# Altium schematic sheet 17-AM64x-06.SchDoc
size B; SheetNumber: 17; SheetTotal: 25
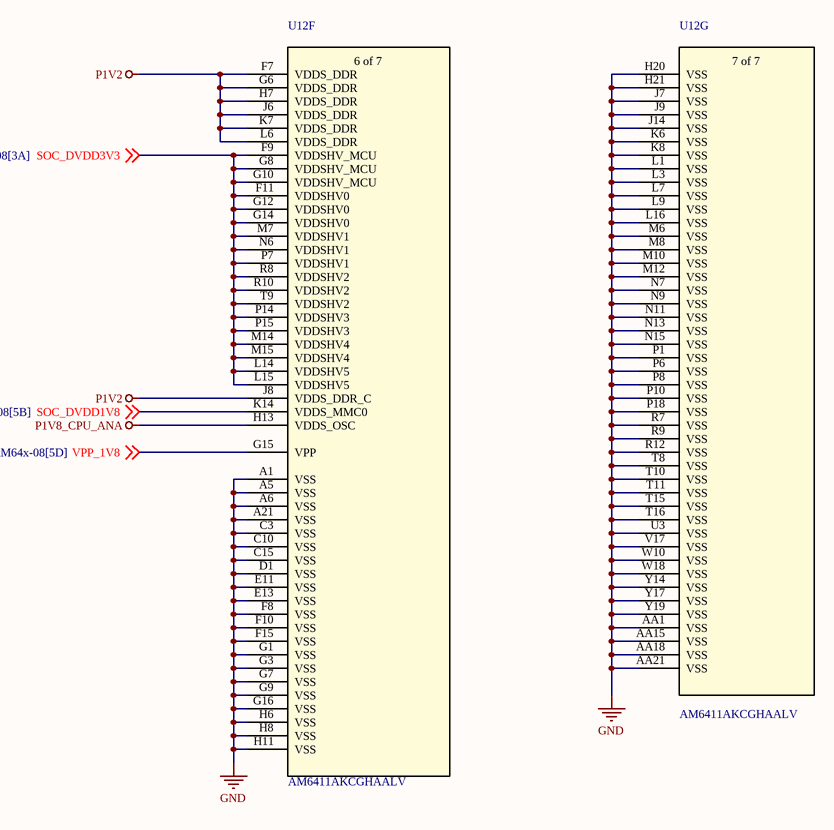
[diagram p0: 17-AM64x-06.SchDoc]

## Parts
U12  AM6411AKCGHAALV  [FCBGA441_ALV_TEX]  (parts F,G of 7)

## Nets
GND: U12.A1(VSS) U12.A5(VSS) U12.A6(VSS) U12.A21(VSS) U12.AA1(VSS) U12.AA15(VSS) U12.AA18(VSS) U12.AA21(VSS) U12.C3(VSS) U12.C10(VSS) U12.C15(VSS) U12.D1(VSS) U12.E11(VSS) U12.E13(VSS) U12.F8(VSS) U12.F10(VSS) U12.F15(VSS) U12.G1(VSS) U12.G3(VSS) U12.G7(VSS) U12.G9(VSS) U12.G16(VSS) U12.H6(VSS) U12.H8(VSS) U12.H11(VSS) U12.H20(VSS) U12.H21(VSS) U12.J7(VSS) U12.J9(VSS) U12.J14(VSS) U12.K6(VSS) U12.K8(VSS) U12.L1(VSS) U12.L3(VSS) U12.L7(VSS) U12.L9(VSS) U12.L16(VSS) U12.M6(VSS) U12.M8(VSS) U12.M10(VSS) U12.M12(VSS) U12.N7(VSS) U12.N9(VSS) U12.N11(VSS) U12.N13(VSS) U12.N15(VSS) U12.P1(VSS) U12.P6(VSS) U12.P8(VSS) U12.P10(VSS) U12.P18(VSS) U12.R7(VSS) U12.R9(VSS) U12.R12(VSS) U12.T8(VSS) U12.T10(VSS) U12.T11(VSS) U12.T15(VSS) U12.T16(VSS) U12.U3(VSS) U12.V17(VSS) U12.W10(VSS) U12.W18(VSS) U12.Y14(VSS) U12.Y17(VSS) U12.Y19(VSS)
P1V2: U12.F7(VDDS_DDR) U12.G6(VDDS_DDR) U12.H7(VDDS_DDR) U12.J6(VDDS_DDR) U12.J8(VDDS_DDR_C) U12.K7(VDDS_DDR) U12.L6(VDDS_DDR)
P1V8_CPU_ANA: U12.H13(VDDS_OSC)
SOC_DVDD1V8: U12.K14(VDDS_MMC0) ; off-sheet SOC_DVDD1V8
SOC_DVDD3V3: U12.F9(VDDSHV_MCU) U12.F11(VDDSHV0) U12.G8(VDDSHV_MCU) U12.G10(VDDSHV_MCU) U12.G12(VDDSHV0) U12.G14(VDDSHV0) U12.L14(VDDSHV5) U12.L15(VDDSHV5) U12.M7(VDDSHV1) U12.M14(VDDSHV4) U12.M15(VDDSHV4) U12.N6(VDDSHV1) U12.P7(VDDSHV1) U12.P14(VDDSHV3) U12.P15(VDDSHV3) U12.R8(VDDSHV2) U12.R10(VDDSHV2) U12.T9(VDDSHV2) ; off-sheet SOC_DVDD3V3
VPP_1V8: U12.G15(VPP) ; off-sheet VPP_1V8

## Notes on the sheet
- (in symbol AM6411AKCGHAALV, part F) 6 of 7
- (in symbol AM6411AKCGHAALV, part G) 7 of 7

## Library data of the parts
U12 = AM6411AKCGHAALV: No Description Available; Mfr_Name: Texas Instruments; RefDes: RefDes; Type: Type